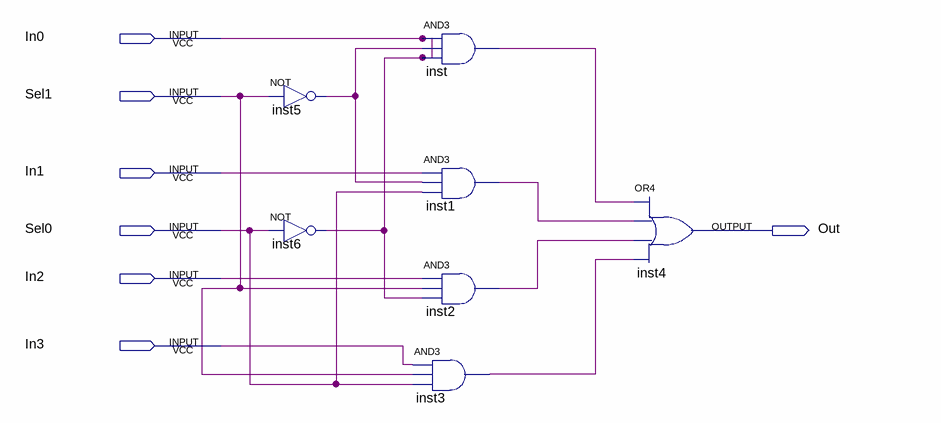
[diagram p0: schematic sheet]
// Quartus schematic Block1.bdf as structural Verilog: 7 symbols, 7 pins
module Block1 (
  input  In0,
  input  Sel1,
  input  In1,
  input  Sel0,
  input  In2,
  input  In3,
  output Out
);

  wire inst1_out, inst2_out, inst3_out, inst5_out, inst_out;

  not inst5 (inst5_out, Sel1);
  not inst6 (In0, Sel0);
  and inst (inst_out, In0, inst5_out, In0);
  and inst1 (inst1_out, In1, inst5_out, Sel0);
  and inst2 (inst2_out, In2, Sel1, In0);
  and inst3 (inst3_out, In3, Sel1, Sel0);
  or inst4 (Out, inst_out, inst1_out, inst2_out, inst3_out);
endmodule
